# EAGLE design Motor Controller (EAGLE 7.6.0)
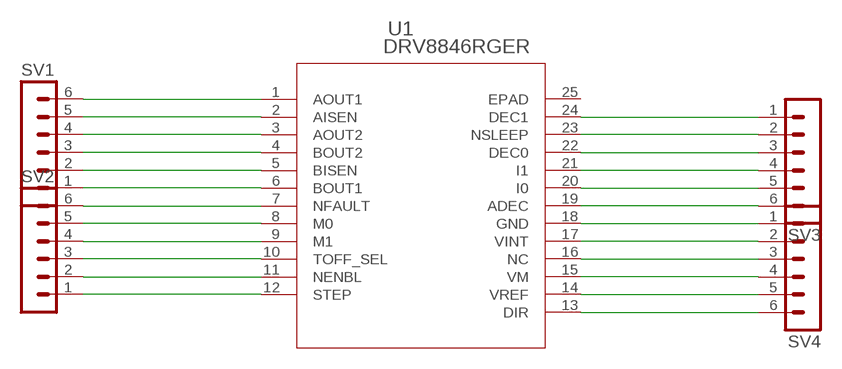
[diagram p0: schematic, sheet 1]

## Parts
SV1  MA06-1  [MA06-1]
SV2  MA06-1  [MA06-1]
SV3  MA06-1  [MA06-1]
SV4  MA06-1  [MA06-1]
U1  DRV8846RGER  [RGE24_2P45X2P45]

## Nets
N$1: SV1.6 U1.1(AOUT1)
N$2: SV1.5 U1.2(AISEN)
N$3: SV1.4 U1.3(AOUT2)
N$4: SV1.3 U1.4(BOUT2)
N$5: SV1.1 U1.6(BOUT1)
N$6: SV1.2 U1.5(BISEN)
N$7: SV2.6 U1.7(NFAULT)
N$8: SV2.5 U1.8(M0)
N$9: SV2.4 U1.9(M1)
N$10: SV2.3 U1.10(TOFF_SEL)
N$11: SV2.2 U1.11(NENBL)
N$12: SV2.1 U1.12(STEP)
N$13: SV4.6 U1.13(DIR)
N$14: SV4.5 U1.14(VREF)
N$15: SV4.4 U1.15(VM)
N$16: SV4.3 U1.16(NC)
N$17: SV4.2 U1.17(VINT)
N$18: SV4.1 U1.18(GND)
N$19: SV3.6 U1.19(ADEC)
N$20: SV3.5 U1.20(I0)
N$21: SV3.4 U1.21(I1)
N$22: SV3.3 U1.22(DEC0)
N$23: SV3.2 U1.23(NSLEEP)
N$24: SV3.1 U1.24(DEC1)
Unconnected: U1.25(EPAD)

## Library data of the parts
SV1-SV4 = con-lstb:MA06-1: PIN HEADER; OC_FARNELL: unknown; OC_NEWARK: unknown
U1 = Beeclust:DRV8846RGER; MANUFACTURER_PART_NUMBER: drv8846rger; VENDOR: Texas Instruments

## Board
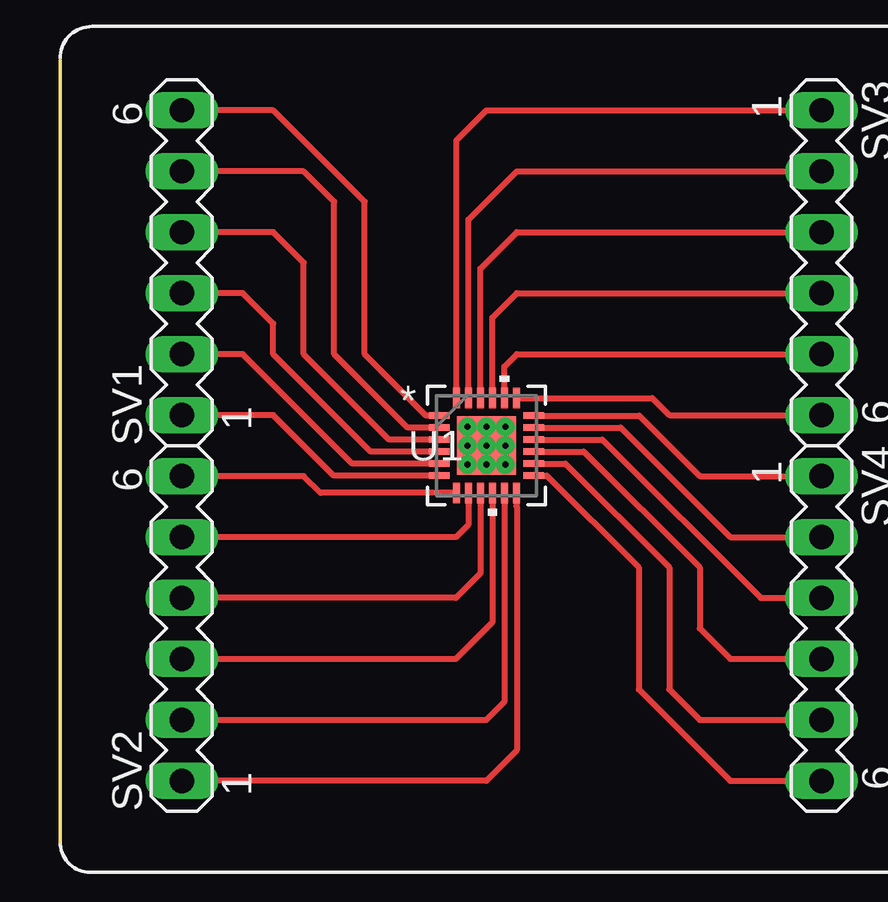
[diagram p1: board, top side]

Size 0 x 32.58 mm. Coordinates in mm from the lower left corner, seen from the top.
Outline: 0,32.58 0,0
Copper layers (1*16): Top 0.035mm / dielectric 1.5mm / Bottom 0.035mm
Design rules "default": minimum track width 10mil, minimum drill 24mil, track to track 8mil, track to pad 8mil, pad to pad 8mil, via to via 8mil, smd to smd 8mil, copper to edge 40mil, drill to drill 8mil, minimum pad ring 10mil, minimum via ring 8mil, stop-mask expansion 4mil, vias tented up to drill 0mil, thermal gap 10mil

### Footprints (pad centres in the part's own frame; a part is rotated, then mirrored left to right if it is on the bottom)
MA06-1 = drill 1.016 long: 1 -6.35,0; 2 -3.81,0; 3 -1.27,0; 4 1.27,0; 5 3.81,0; 6 6.35,0
RGE24_2P45X2P45 = smd 0.85 x 0.28: 1 -1.975,1.25; 2 -1.975,0.75; 3 -1.975,0.25; 4 -1.975,-0.25; 5 -1.975,-0.75; 6 -1.975,-1.25; 13 1.975,-1.25; 14 1.975,-0.75; 15 1.975,-0.25; 16 1.975,0.25; 17 1.975,0.75; 18 1.975,1.25 | smd 0.28 x 0.85: 7 -1.25,-1.975; 8 -0.75,-1.975; 9 -0.25,-1.975; 10 0.25,-1.975; 11 0.75,-1.975; 12 1.25,-1.975; 19 1.25,1.975; 20 0.75,1.975; 21 0.25,1.975; 22 -0.25,1.975; 23 -0.75,1.975; 24 -1.25,1.975 | smd 2.45 x 2.45: 25 0,0 | drill 0.254 pad 0.508: V -0.787,-0.787; V_1 -0.787,0; V_2 -0.787,0.787; V_3 0,-0.787; V_4 0,0; V_5 0,0.787; V_6 0.787,-0.787; V_7 0.787,0; V_8 0.787,0.787

### Placement (x,y rotation side)
SV1  5.08,24.13 90 top  (outside the outline)
SV2  5.08,8.89 90 top  (outside the outline)
SV3  31.75,24.13 270 top  (outside the outline)
SV4  31.75,8.89 270 top  (outside the outline)
U1  17.78,16.51 0 top  (outside the outline)

### Tracks (layer width: path | path; a pad name or v marks a point on that pad's centre or on a via)
N$1
  Top 0.254: U1.1 15.26,17.76 12.7,20.32 12.7,26.67 8.89,30.48 SV1.6
N$2
  Top 0.254: U1.2 14.49,17.26 11.43,20.32 11.43,26.67 10.16,27.94 SV1.5
N$3
  Top 0.254: U1.3 13.72,16.76 10.16,20.32 10.16,24.13 8.89,25.4 SV1.4
N$4
  Top 0.254: U1.4 12.95,16.26 8.89,20.32 8.89,21.59 7.62,22.86 SV1.3
N$5
  Top 0.254: U1.6 11.41,15.26 8.89,17.78 SV1.1
N$6
  Top 0.254: U1.5 12.18,15.76 7.62,20.32 SV1.2
N$7
  Top 0.254: U1.7 10.87,14.54 10.16,15.24 SV2.6
N$8
  Top 0.254: U1.8 17.03,13.22 16.51,12.7 SV2.5
N$9
  Top 0.254: U1.9 17.53,11.18 16.51,10.16 SV2.4
N$10
  Top 0.254: U1.10 18.03,9.14 16.51,7.62 SV2.3
N$11
  Top 0.254: U1.11 18.53,5.83 17.78,5.08 SV2.2
N$12
  Top 0.254: U1.12 19.03,13.99 19.05,13.97 19.05,3.81 17.78,2.54 SV2.1
N$13
  Top 0.254: U1.13 20.3,15.26 24.13,11.43 24.13,6.35 27.94,2.54 SV4.6
N$14
  Top 0.254: U1.14 21.07,15.76 25.4,11.43 25.4,6.35 26.67,5.08 SV4.5
N$15
  Top 0.254: U1.15 21.84,16.26 26.67,11.43 26.67,8.89 27.94,7.62 SV4.4
N$16
  Top 0.254: U1.16 22.61,16.76 29.21,10.16 SV4.3
N$17
  Top 0.254: U1.17 23.38,17.26 27.94,12.7 SV4.2
N$18
  Top 0.254: U1.18 24.15,17.76 26.67,15.24 SV4.1
N$19
  Top 0.254: U1.19 24.7,18.48 25.4,17.78 SV3.6
N$20
  Top 0.254: U1.20 18.53,19.8 19.05,20.32 SV3.5
N$21
  Top 0.254: U1.21 18.03,21.84 19.05,22.86 SV3.4
N$22
  Top 0.254: U1.22 17.53,23.88 19.05,25.4 SV3.3
N$23
  Top 0.254: U1.23 17.03,25.92 19.05,27.94 SV3.2
N$24
  Top 0.254: U1.24 16.53,29.23 17.78,30.48 SV3.1

### Text on the board
bNames: #KarpeDiem | Beeclust-MRSL